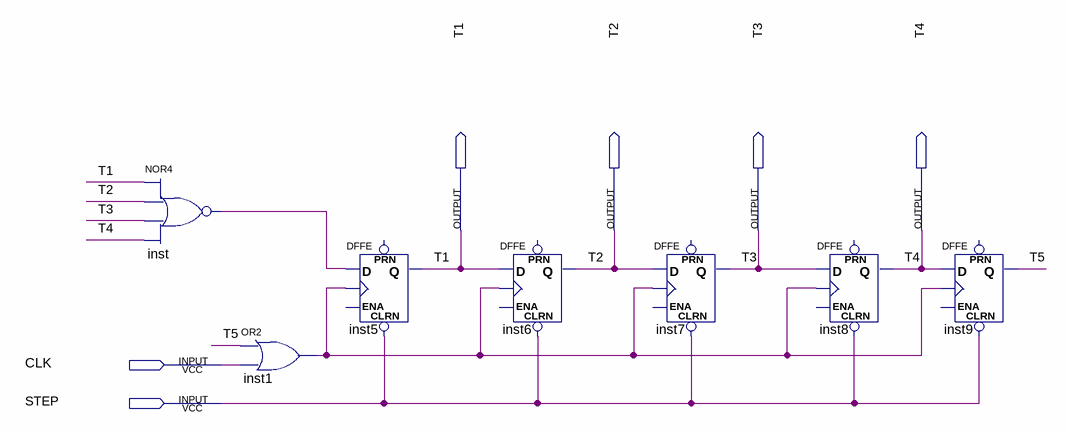
[diagram p0: schematic sheet]
// Quartus schematic step.bdf as structural Verilog: 7 symbols, 6 pins
module step (
  input  CLK,
  input  STEP,
  output T1,
  output T2,
  output T3,
  output T4
);

  wire inst1_out, inst_out, T5;

  nor inst (inst_out, T1, T2, T3, T4);
  or inst1 (inst1_out, T5, CLK);
  DFFE inst5 (.CLRN(STEP), .D(inst_out), .CLK(inst1_out), .Q(T1));  // open: PRN, ENA
  DFFE inst6 (.CLRN(STEP), .D(T1), .CLK(inst1_out), .Q(T2));  // open: PRN, ENA
  DFFE inst7 (.CLRN(STEP), .D(T2), .CLK(inst1_out), .Q(T3));  // open: PRN, ENA
  DFFE inst8 (.CLRN(STEP), .D(T3), .CLK(inst1_out), .Q(T4));  // open: PRN, ENA
  DFFE inst9 (.CLRN(STEP), .D(T4), .CLK(inst1_out), .Q(T5));  // open: PRN, ENA
endmodule
